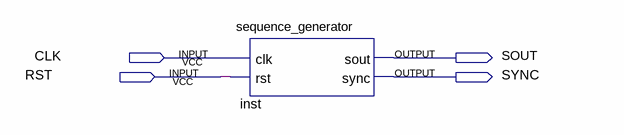
[diagram p0: schematic sheet]
// Quartus schematic sequence_generator_test.bdf as structural Verilog: 1 symbols, 4 pins
module sequence_generator_test (
  input  CLK,
  input  RST,
  output SOUT,
  output SYNC
);

  sequence_generator inst (.clk(CLK), .rst(RST), .sout(SOUT), .sync(SYNC));
endmodule
